# EAGLE schematic TSOC_NEOLED_28pin (EAGLE 6.6.0)
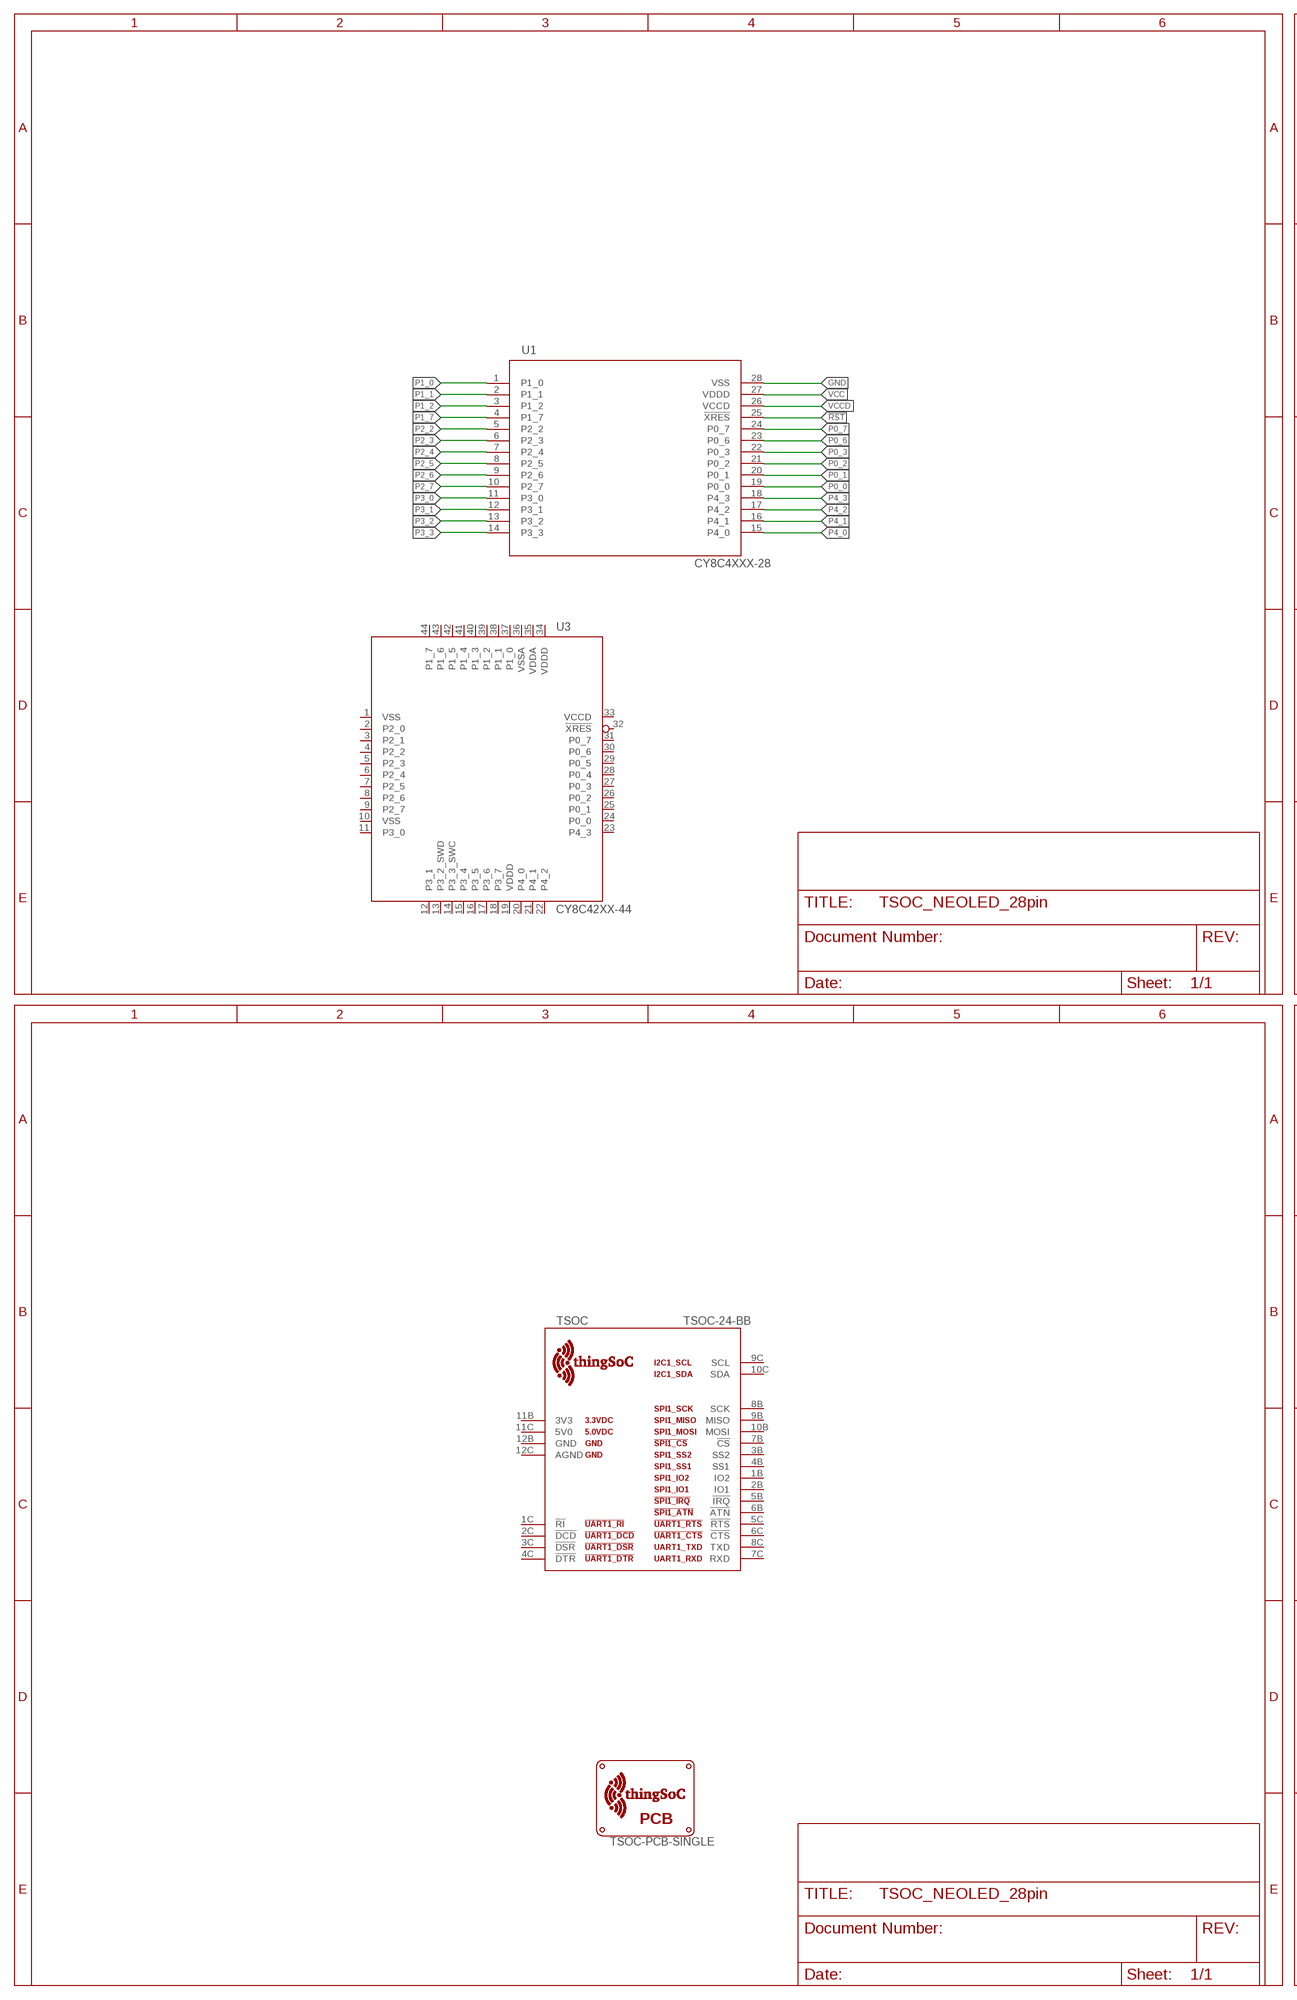
[diagram p0: schematic, sheet 1, part 1 of 2]
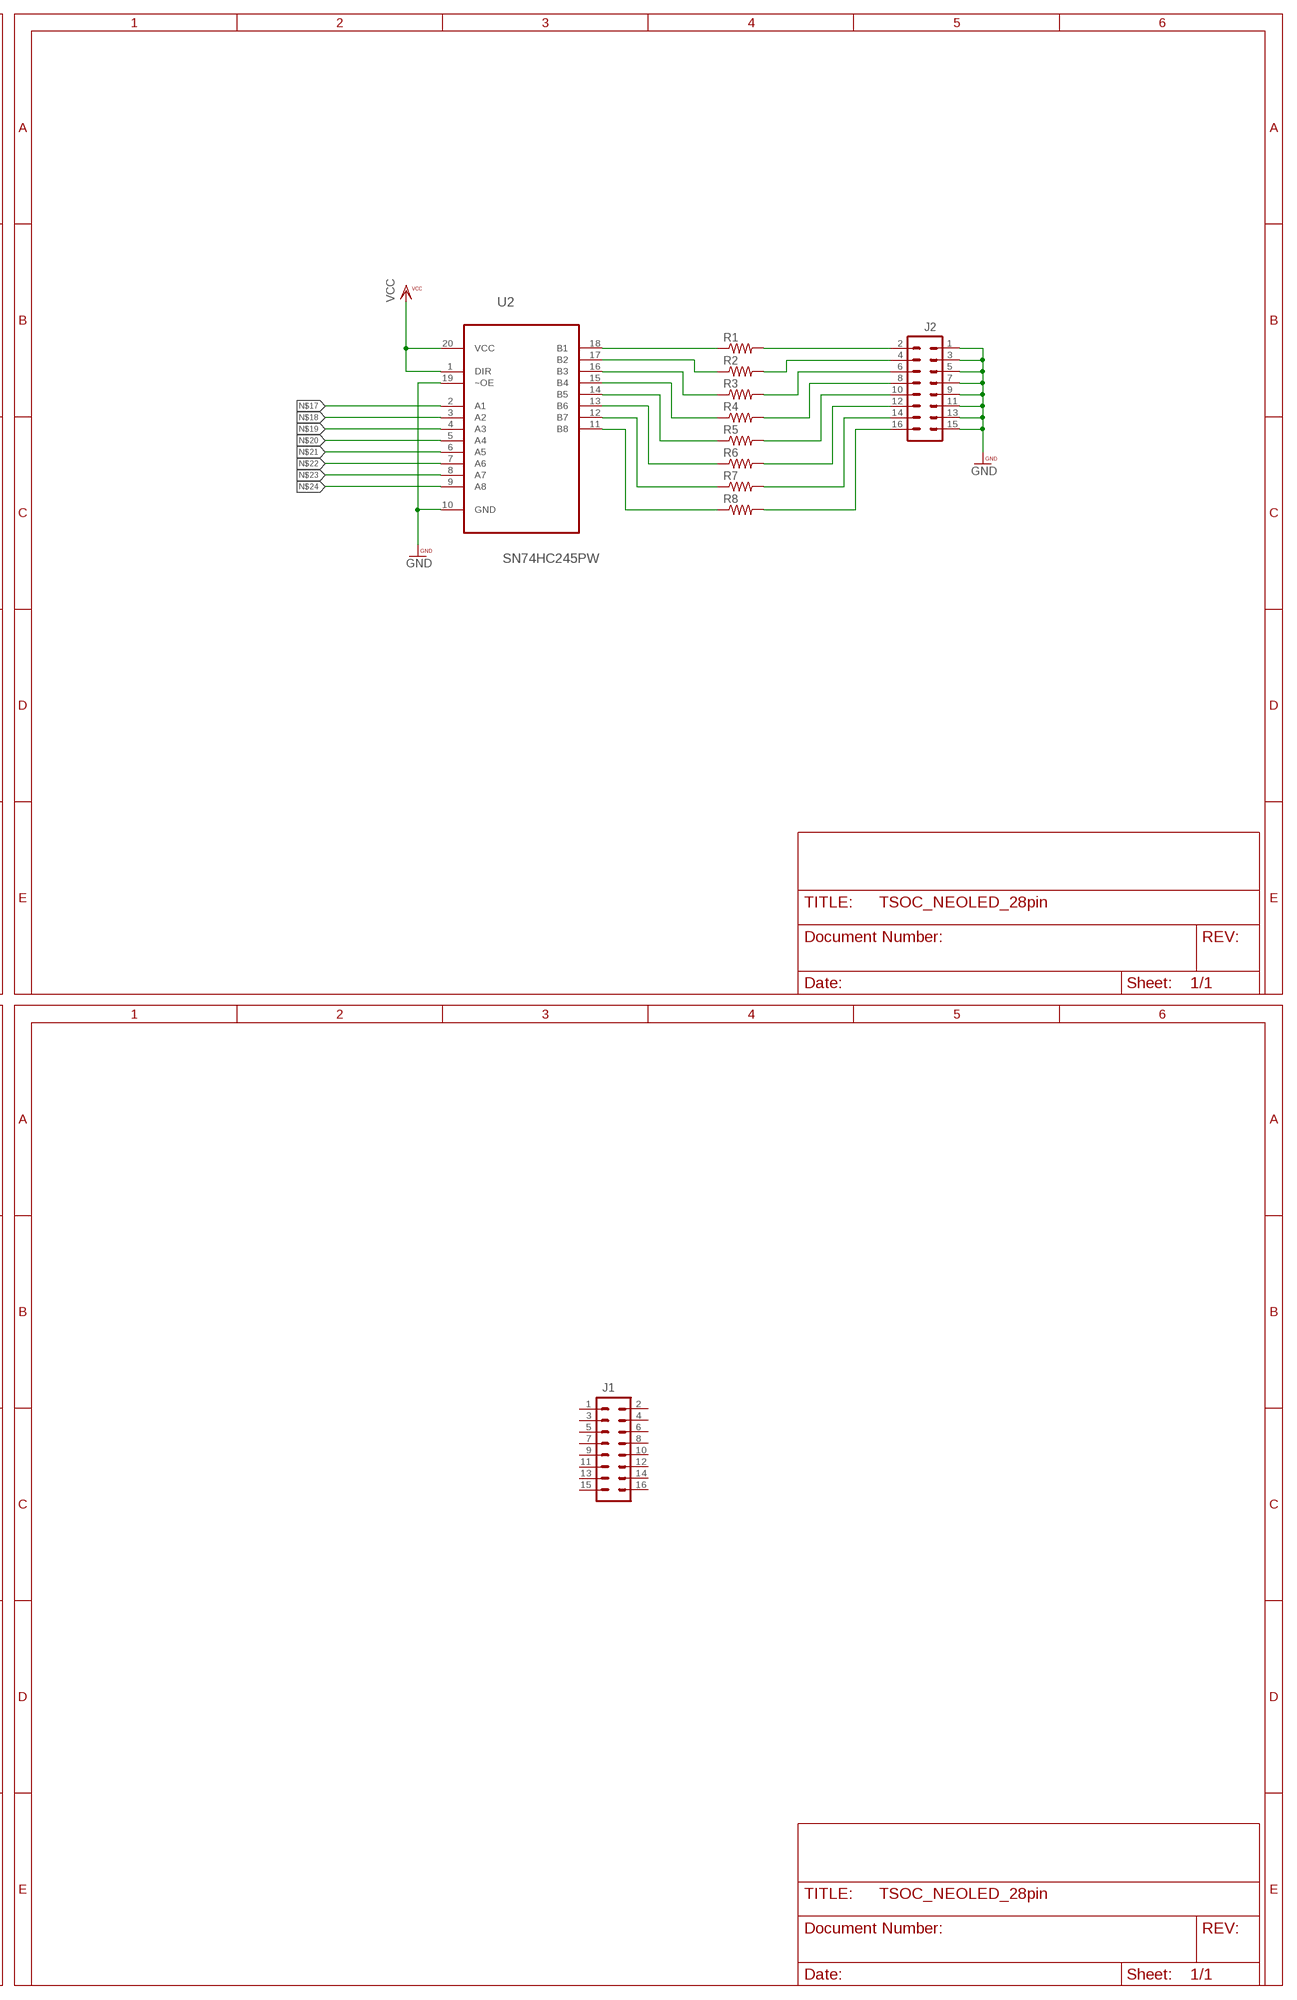
[diagram p1: schematic, sheet 1, part 2 of 2]

## Parts
J1  M08X2  [2X8]
J2  M08X2  [2X8]
R1  RESISTOR0603-RES  [0603-RES]
R2  RESISTOR0603-RES  [0603-RES]
R3  RESISTOR0603-RES  [0603-RES]
R4  RESISTOR0603-RES  [0603-RES]
R5  RESISTOR0603-RES  [0603-RES]
R6  RESISTOR0603-RES  [0603-RES]
R7  RESISTOR0603-RES  [0603-RES]
R8  RESISTOR0603-RES  [0603-RES]
TSOC  TSOC-24-BB  [TSOC-BB-S24]
U1  CY8C4XXX-28  [SSOP28]
U2  SN74HC245PW  [SOP65P640X120-20N]
U3  CY8C42XX-44  [TQFP-10X10-44]
U$3  TSOC-PCB-SINGLE  [TSOC-BB-BRD]

## Nets
!RST: U1.25(!XRES)
GND: J2.1 J2.3 J2.5 J2.7 J2.9 J2.11 J2.13 J2.15 U1.28(VSS) U2.10(GND) U2.19(~OE)
N$1: J2.2 R1.2
N$2: J2.4 R2.2
N$3: J2.6 R3.2
N$4: J2.8 R4.2
N$5: J2.10 R5.2
N$6: J2.12 R6.2
N$7: J2.14 R7.2
N$8: J2.16 R8.2
N$9: R1.1 U2.18(B1)
N$10: R2.1 U2.17(B2)
N$11: R3.1 U2.16(B3)
N$12: R4.1 U2.15(B4)
N$13: R5.1 U2.14(B5)
N$14: R6.1 U2.13(B6)
N$15: R7.1 U2.12(B7)
N$16: R8.1 U2.11(B8)
N$17: U2.2(A1)
N$18: U2.3(A2)
N$19: U2.4(A3)
N$20: U2.5(A4)
N$21: U2.6(A5)
N$22: U2.7(A6)
N$23: U2.8(A7)
N$24: U2.9(A8)
P0_0: U1.19(P0_0)
P0_1: U1.20(P0_1)
P0_2: U1.21(P0_2)
P0_3: U1.22(P0_3)
P0_6: U1.23(P0_6)
P0_7: U1.24(P0_7)
P1_0: U1.1(P1_0)
P1_1: U1.2(P1_1)
P1_2: U1.3(P1_2)
P1_7: U1.4(P1_7)
P2_2: U1.5(P2_2)
P2_3: U1.6(P2_3)
P2_4: U1.7(P2_4)
P2_5: U1.8(P2_5)
P2_6: U1.9(P2_6)
P2_7: U1.10(P2_7)
P3_0: U1.11(P3_0)
P3_1: U1.12(P3_1)
P3_2: U1.13(P3_2)
P3_3: U1.14(P3_3)
P4_0: U1.15(P4_0)
P4_1: U1.16(P4_1)
P4_2: U1.17(P4_2)
P4_3: U1.18(P4_3)
VCC: U1.27(VDDD) U2.1(DIR) U2.20(VCC)
VCCD: U1.26(VCCD)
Unconnected: J1.1 J1.2 J1.3 J1.4 J1.5 J1.6 J1.7 J1.8 J1.9 J1.10 J1.11 J1.12 J1.13 J1.14 J1.15 J1.16 TSOC.1B(IO2) TSOC.1C(!RI) TSOC.2B(IO1) TSOC.2C(!DCD) TSOC.3B(SS2) TSOC.3C(!DSR) TSOC.4B(SS1) TSOC.4C(!DTR) TSOC.5B(!IRQ) TSOC.5C(!RTS) TSOC.6B(!ATN) TSOC.6C(!CTS) TSOC.7B(!CS) TSOC.7C(RXD) TSOC.8B(SCK) TSOC.8C(TXD) TSOC.9B(MISO) TSOC.9C(SCL) TSOC.10B(MOSI) TSOC.10C(SDA) TSOC.11B(3V3) TSOC.11C(5V0) TSOC.12B(GND) TSOC.12C(AGND) U3.1(VSS) U3.2(P2_0) U3.3(P2_1) U3.5(P2_3) U3.6(P2_4) U3.7(P2_5) U3.9(P2_7) U3.10(VSS) U3.11(P3_0) U3.12(P3_1) U3.13(P3_2_SWD) U3.14(P3_3_SWC) U3.15(P3_4) U3.16(P3_5) U3.18(P3_7) U3.19(VDDD) U3.20(P4_0) U3.21(P4_1) U3.22(P4_2) U3.23(P4_3) U3.24(P0_0) U3.25(P0_1) U3.26(P0_2) U3.27(P0_3) U3.28(P0_4) U3.29(P0_5) U3.31(P0_7) U3.32(!XRES) U3.33(VCCD) U3.34(VDDD) U3.35(VDDA) U3.36(VSSA) U3.37(P1_0) U3.38(P1_1) U3.40(P1_3) U3.41(P1_4) U3.42(P1_5) U3.43(P1_6) U3.44(P1_7)

## Power pins joined to a net without a drawn wire
P0_6: U3.30(P0_6)
P1_2: U3.39(P1_2)
P2_2: U3.4(P2_2)
P2_6: U3.8(P2_6)
P3_6: U3.17(P3_6)

## Library data of the parts
J1 J2 = PatternAgents-ProtoPads:M08X2: .1" headers, two rows of 8 each
R1-R8 = PatternAgents-ProtoPads:RESISTOR: Resistor Basic schematic elements and footprints for 0603, 1206, and PTH resistors.
TSOC = thingSoC:TSOC-24: thingSoC Twenty-Four(24) Pin Socket Source LBR : http://www.thingsoc.com Github : https://github.com/thingsoc License : http://creativecommons.org/licenses/by-sa/4.0/ (Creative Commons 4.0) THIS SOFTWARE IS PROVIDED BY THE CONTRIBUTORS "AS IS" AND WITHOUT ANY EXPRESS OR IMPLIED WARRANTIES, INCLUDING, BUT NOT LIMITED TO, THE IMPLIED WARRANTIES OF MERCHANTABILITY AND FITNESS FOR A PARTICULAR PURPOSE ARE DISCLAIMED. IN NO EVENT SHALL THE COPYRIGHT OWNER OR CONTRIBUTORS BE LIABLE FOR ANY DIRECT, INDIRECT, INCIDENTAL, SPECIAL, EXEMPLARY, OR CONSEQUENTIAL DAMAGES (INCLUDING, BUT NOT LIMITED TO, PROCUREMENT OF SUBSTITUTE GOODS OR SERVICES; LOSS OF USE, DATA, OR PROFITS; OR BUSINESS INTERRUPTION) HOWEVER CAUSED AND ON ANY THEORY OF LIABILITY, WHETHER IN CONTRACT, STRICT LIABILITY, OR TORT (INCLUDING NEGLIGENCE OR OTHERWISE) ARISING IN ANY WAY OUT OF THE USE OF THIS SOFTWARE, EVEN IF ADVISED OF THE POSSIBILITY OF SUCH DAMAGE.
U1 = PatternAgents-Cypress:CY8C4XXX-28: Cypress PSoC® 4 - Programmable System on Chip, Cortex-M0 Based http://www.cypress.com/?mpn=CY8C4245PVI-482 LBR Source: http://www.patternagents.com THIS SOFTWARE IS PROVIDED BY THE CONTRIBUTORS "AS IS" AND WITHOUT ANY EXPRESS OR IMPLIED WARRANTIES, INCLUDING, BUT NOT LIMITED TO, THE IMPLIED WARRANTIES OF MERCHANTABILITY AND FITNESS FOR A PARTICULAR PURPOSE ARE DISCLAIMED. IN NO EVENT SHALL THE COPYRIGHT OWNER OR CONTRIBUTORS BE LIABLE FOR ANY DIRECT, INDIRECT, INCIDENTAL, SPECIAL, EXEMPLARY, OR CONSEQUENTIAL DAMAGES (INCLUDING, BUT NOT LIMITED TO, PROCUREMENT OF SUBSTITUTE GOODS OR SERVICES; LOSS OF USE, DATA, OR PROFITS; OR BUSINESS INTERRUPTION) HOWEVER CAUSED AND ON ANY THEORY OF LIABILITY, WHETHER IN CONTRACT, STRICT LIABILITY, OR TORT (INCLUDING NEGLIGENCE OR OTHERWISE) ARISING IN ANY WAY OUT OF THE USE OF THIS SOFTWARE, EVEN IF ADVISED OF THE POSSIBILITY OF SUCH DAMAGE.
U2 = PatternAgents-TI:SN74HC245PW: OCTAL BUS TRANSCEIVERS; MPN: SN74HC245PW; OC_FARNELL: 1236221; OC_NEWARK: 13M5213; PACKAGE: TSSOP-20; SUPPLIER: Texas Instruments
U3 = PatternAgents-Cypress:CY8C42XX-44: Cypress PSoC® 4 - Programmable System on Chip, Cortex-M0 Based http://www.cypress.com/?mpn=CY8C4245AXI-483 LBR Source: http://www.patternagents.com THIS SOFTWARE IS PROVIDED BY THE CONTRIBUTORS "AS IS" AND WITHOUT ANY EXPRESS OR IMPLIED WARRANTIES, INCLUDING, BUT NOT LIMITED TO, THE IMPLIED WARRANTIES OF MERCHANTABILITY AND FITNESS FOR A PARTICULAR PURPOSE ARE DISCLAIMED. IN NO EVENT SHALL THE COPYRIGHT OWNER OR CONTRIBUTORS BE LIABLE FOR ANY DIRECT, INDIRECT, INCIDENTAL, SPECIAL, EXEMPLARY, OR CONSEQUENTIAL DAMAGES (INCLUDING, BUT NOT LIMITED TO, PROCUREMENT OF SUBSTITUTE GOODS OR SERVICES; LOSS OF USE, DATA, OR PROFITS; OR BUSINESS INTERRUPTION) HOWEVER CAUSED AND ON ANY THEORY OF LIABILITY, WHETHER IN CONTRACT, STRICT LIABILITY, OR TORT (INCLUDING NEGLIGENCE OR OTHERWISE) ARISING IN ANY WAY OUT OF THE USE OF THIS SOFTWARE, EVEN IF ADVISED OF THE POSSIBILITY OF SUCH DAMAGE.
U$3 = thingSoC:TSOC-PCB: thingSoC PCB Outlines Boards Outlines for Standard Sizes (in the DImension Layer) (Registration marks in the tDocu layer - make sure to turn on tDocu/bDocu) Source LBR : http://www.thingsoc.com Github : https://github.com/thingsoc License : http://creativecommons.org/licenses/by-sa/4.0/ (Creative Commons 4.0) THIS SOFTWARE IS PROVIDED BY THE CONTRIBUTORS "AS IS" AND WITHOUT ANY EXPRESS OR IMPLIED WARRANTIES, INCLUDING, BUT NOT LIMITED TO, THE IMPLIED WARRANTIES OF MERCHANTABILITY AND FITNESS FOR A PARTICULAR PURPOSE ARE DISCLAIMED. IN NO EVENT SHALL THE COPYRIGHT OWNER OR CONTRIBUTORS BE LIABLE FOR ANY DIRECT, INDIRECT, INCIDENTAL, SPECIAL, EXEMPLARY, OR CONSEQUENTIAL DAMAGES (INCLUDING, BUT NOT LIMITED TO, PROCUREMENT OF SUBSTITUTE GOODS OR SERVICES; LOSS OF USE, DATA, OR PROFITS; OR BUSINESS INTERRUPTION) HOWEVER CAUSED AND ON ANY THEORY OF LIABILITY, WHETHER IN CONTRACT, STRICT LIABILITY, OR TORT (INCLUDING NEGLIGENCE OR OTHERWISE) ARISING IN ANY WAY OUT OF THE USE OF THIS SOFTWARE, EVEN IF ADVISED OF THE POSSIBILITY OF SUCH DAMAGE.